# Altium schematic sheet Sheet1.SchDoc
size A; SheetNumber: 1; SheetTotal: 1
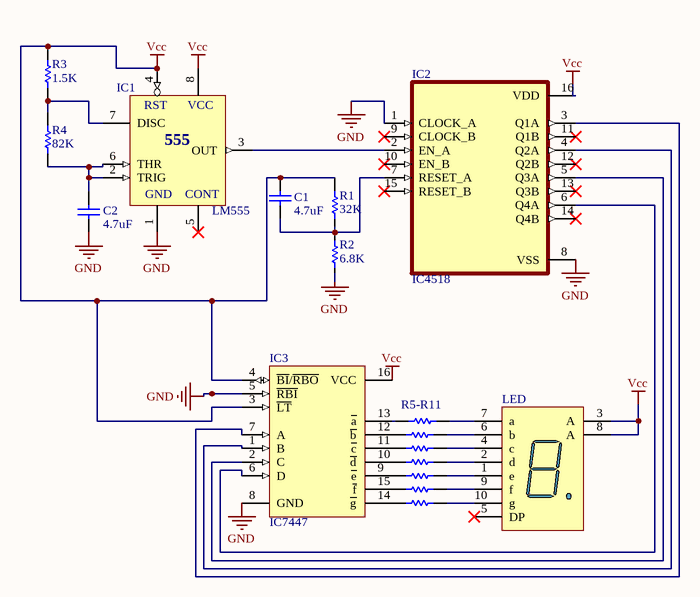
[diagram p0: Sheet1.SchDoc]

## Parts
C1  value 4.7uF  [C3MM]  (hidden comment: Cap)
C2  value 4.7uF  [C3MM]  (hidden comment: Cap)
IC1  LM555  [DIP8]
IC2  IC4518  [DIP794W45P254L1969H508Q16]
IC3  IC7447  [DIP16/W0.3]
LED  7SEG-A  [LED7SEG]  (value not drawn)
R1  32K  [Res 0805 SMD]
R2  6.8K  [Res 0805 SMD]
R3  1.5K  [Res 0805 SMD]
R4  82K  [Res 0805 SMD]
R5  470  [Res 0805 SMD]  (value not drawn)
R6  470  [Res 0805 SMD]  (value not drawn)
R7  470  [Res 0805 SMD]  (value not drawn)
R8  470  [Res 0805 SMD]  (value not drawn)
R9  470  [Res 0805 SMD]  (value not drawn)
R10  470  [Res 0805 SMD]  (value not drawn)
R11  470  [Res 0805 SMD]  (value not drawn)

## Nets
GND: C2.1 IC1.1(GND) IC2.1(CLOCK_A) IC2.8(VSS) IC3.5(~{RBI}) IC3.8(GND) R2.1
Vcc: C1.2 IC1.4(RST) IC1.8(VCC) IC2.16(VDD) IC3.3(~{LT}) IC3.4(~{BI}/~{RBO}) IC3.16(VCC) LED.3(A) LED.8(A) R1.2 R3.2
NetC1_1: C1.1 IC2.7(RESET_A) R1.1 R2.2
NetC2_2: C2.2 IC1.2(TRIG) IC1.6(THR) R4.1
NetIC1_3: IC1.3(OUT) IC2.2(EN_A)
NetIC1_7: IC1.7(DISC) R3.1 R4.2
NetIC2_3: IC2.3(Q1A) IC3.7(A)
NetIC2_4: IC2.4(Q2A) IC3.1(B)
NetIC2_5: IC2.5(Q3A) IC3.2(C)
NetIC2_6: IC2.6(Q4A) IC3.6(D)
NetIC3_9: IC3.9(~{e}) R9.1
NetIC3_10: IC3.10(~{d}) R8.1
NetIC3_11: IC3.11(~{c}) R7.1
NetIC3_12: IC3.12(~{b}) R6.1
NetIC3_13: IC3.13(~{a}) R5.2
NetIC3_14: IC3.14(~{g}) R11.1
NetIC3_15: IC3.15(~{f}) R10.1
NetLED_1: LED.1(e) R9.2
NetLED_2: LED.2(d) R8.2
NetLED_4: LED.4(c) R7.2
NetLED_6: LED.6(b) R6.2
NetLED_7: LED.7(a) R5.1
NetLED_9: LED.9(f) R10.2
NetLED_10: LED.10(g) R11.2

Not connected (* = marked no-connect by the designer): IC1 5(CONT)*; IC2 9(CLOCK_B)* 10(EN_B)* 11(Q1B)* 12(Q2B)* 13(Q3B)* 14(Q4B)* 15(RESET_B)*; LED 5(DP)*

## Notes on the sheet
- (near R5) R5-R11
- (in symbol LM555) 555

## Library data of the parts
C1 C2 = Cap: Capacitor; Published: 8-Jun-2000; LatestRevisionDate: 17-Jul-2002; LatestRevisionNote: Re-released for DXP Platform.; PackageReference: RAD-0.3; Publisher: Altium Limited
IC1 = LM555: Timer; Value: LM555
IC2 = CD4518BE: CMOS Dual BCD Up-Counter 16-PDIP -55 to 125; MF: Texas Instruments; SnapEDA_Link: https://www.snapeda.com/parts/CD4518BE/Texas%20Instruments/view-part/2251593/?ref=snap; Purchase-URL: https://pricing.snapeda.com/search/part/CD4518BE/?ref=eda; Availability: Good; MP: CD4518BE; Value: *; Price: None; Package: PDIP-16 Texas Instruments; Check_prices: https://www.snapeda.com/parts/CD4518BE/Texas%20Instruments/view-part/2251593/?ref=eda
IC3 = 7447: BCD to 7-Segment Decoder/Driver; Value: 7447 , 74247
LED = LED7SEG-A: 14.2 mm General Purpose Blue 7-Segment Display: CA, RH DP, Gray Surface; MinimumIntensity: 2020 ucd; Note: IF = 10 mA; Published: 8-Jun-2000; LatestRevisionDate: 17-Dec-2003; LatestRevisionNote: Schematic revised, PCB Footprint replaced.; DatasheetDocument: 24-Sep-2002; PackageDocument: 24-Sep-2002; PackageReference: H; Publisher: Altium Limited; Colour: Blue; ComponentLink1Description: Manufacturer Link; ComponentLink1URL: http://www.agilent.com/
R1-R11 = RES-0805: RES SMD 249K OHM 1% 1/10W 0805; Manufacturer: Yageo; Manufacturer Part Number: RC0603FR-07249KL; Power (Watts): 0.1W, 1/10W; Temperature Coefficient: ±100ppm/°C; Supplier 1: Digi-Key; RoHS: RoHS Compliant; Category: Resistors; Stock 1: 370515; Pricing 1: 1=0.1, 10=0.015, 100=0.006, 1000=0.00268, 2500=0.00233 (USD); Packaging: Cut Tape (CT); Part Status: Active; Tolerance: ±1%; Composition: Thick Film; Features: Moisture Resistant; Operating Temperature: -55°C ~ 155°C; Package / Case: 0603 (1608 Metric); Supplier Device Package: 0603; Size / Dimension: 0.063" L x 0.032" W (1.60mm x 0.80mm); Height - Seated (Max): 0.022" (0.55mm); Failure Rate: -; ComponentLink1URL: http://www.yageo.com/documents/recent/PYu-RC_Group_51_RoHS_L_8.pdf; ComponentLink1Description: http://www.yageo.com/documents/recent/PYu-RC_Group_51_RoHS_L_8.pdf